# Altium schematic sheet [11] - TK2560_ISP.SchDoc
size A4; Organization: Altium Limited; Address1: L3, 12a Rodborough Rd; Address2: Frenchs Forest; Address3: NSW; Address4: Australia 2086; SheetNumber: 12; SheetTotal: 15
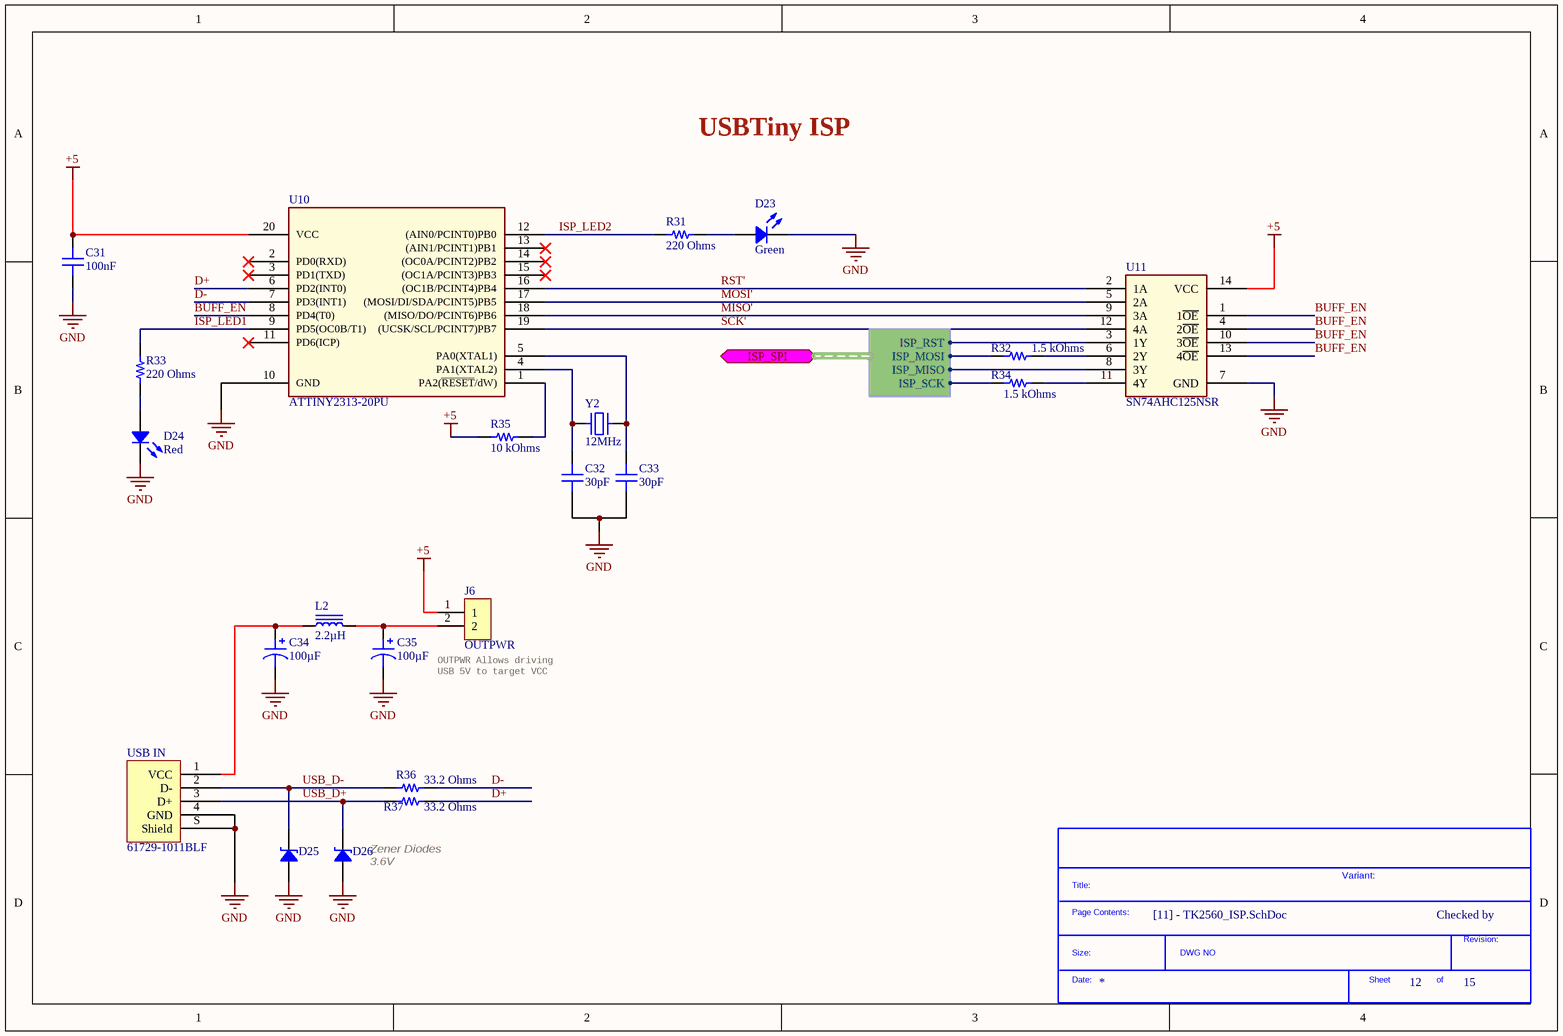
[diagram p0: [11] - TK2560_ISP.SchDoc]

## Parts
*?  SDTitleBlock  (value not drawn)  (graphical)
C31  100nF  [CAP 0805_2012]
C32  30pF  [CAP 0805_2012]
C33  30pF  [CAP 0805_2012]
C34  100µF  [CAP ALSMD 6.6MM H5.4MM]
C35  100µF  [CAP ALSMD 6.6MM H5.4MM]
D23  Green  [LED 0805_2012 GREEN]
D24  Red  [LED 1206_3216 RED]
D25  MMSZ5227B-E3-08  [SOD-123]  (value not drawn)
D26  MMSZ5227B-E3-08  [SOD-123]  (value not drawn)
J6  OUTPWR  [HDR_1x2]
L2  2.2µH  [IND 0806_2016]
R31  220 Ohms  [RES 0805_2012]
R32  1.5 kOhms  [RES 0805_2012]
R33  220 Ohms  [RES 0805_2012]
R34  1.5 kOhms  [RES 0805_2012]
R35  10 kOhms  [RES 0805_2012]
R36  33.2 Ohms  [RES 0805_2012]
R37  33.2 Ohms  [RES 0805_2012]
U10  ATTINY2313-20PU  [DIP20]
U11  SN74AHC125NSR  [14-SOIC_5.3MM]
USB_IN  61729-1011BLF  [FCI USB 61729-1011BLF]
Y2  12MHz  [ABRACON ABLS]

## Ports
ISP_SPI (bidir, harness ISP_SPI)

## Harnesses
ISP_SPI: ISP_RST, ISP_MOSI, ISP_MISO, ISP_SCK

## Nets
+5: C31.2 J6.1 R35.2 U10.20(VCC) U11.14(VCC)
GND: C31.1 C32.2 C33.2 C34.2 C35.2 D23.2 D24.2 D25.1 D26.1 U10.10(GND) U11.7(GND) USB_IN.4(GND) USB_IN.S(Shield)
BUFF_EN: U10.8(PD4(T0)) U11.1(1~{OE}) U11.4(2~{OE}) U11.10(3~{OE}) U11.13(4~{OE})
D+: R37.2 U10.6(PD2(INT0))
D-: R36.2 U10.7(PD3(INT1))
ISP_LED1: R33.2 U10.9(PD5(OC0B/T1))
ISP_LED2: R31.1 U10.12((AIN0/PCINT0)PB0)
MISO': U10.18((MISO/DO/PCINT6)PB6) U11.9(3A)
MOSI': U10.17((MOSI/DI/SDA/PCINT5)PB5) U11.5(2A)
RST': U10.16((OC1B/PCINT4)PB4) U11.2(1A)
SCK': U10.19((UCSK/SCL/PCINT7)PB7) U11.12(4A)
USB_D+: D26.2 R37.1 USB_IN.3(D+)
USB_D-: D25.2 R36.1 USB_IN.2(D-)
NetC32_1: C32.1 U10.4(PA1(XTAL2)) Y2.2
NetC33_1: C33.1 U10.5(PA0(XTAL1)) Y2.1
NetC34_1: C34.1 L2.1 USB_IN.1(VCC)
NetC35_1: C35.1 J6.2 L2.2
NetD23_1: D23.1 R31.2
NetD24_1: D24.1 R33.1
NetR32_1: R32.1 ; port ISP_SPI.ISP_MOSI
NetR32_2: R32.2 U11.6(2Y)
NetR34_1: R34.1 ; port ISP_SPI.ISP_SCK
NetR34_2: R34.2 U11.11(4Y)
NetR35_1: R35.1 U10.1(PA2(~{RESET}/dW))
NetU11_3: U11.3(1Y) ; port ISP_SPI.ISP_RST
NetU11_8: U11.8(3Y) ; port ISP_SPI.ISP_MISO

Not connected (* = marked no-connect by the designer): U10 2(PD0(RXD))* 3(PD1(TXD))* 11(PD6(ICP))* 13((AIN1/PCINT1)PB1)* 14((OC0A/PCINT2)PB2)* 15((OC1A/PCINT3)PB3)*

## Notes on the sheet
- USBTiny ISP
- (near J6) OUTPWR Allows driving USB 5V to target VCC
- Zener Diodes 3.6V
- Variant:
- Checked by
- Title
- Size:
- Date:
- A4
- Number:
- Time:
- Revision:
- Sheet
- of
- File:
- (in symbol SDTitleBlock) Title:; Page Contents:; Revision:; Size:; DWG NO; Date:; Sheet; of

## Library data of the parts
C31 = AC0805KKX8R9BB104: CAP CER 0805 10% X8R 50V 100NF; Manufacturer: Yageo; Capacitance: 0.1µF; Part Number: AC0805KKX8R9BB104; Value: 100nF; Applications: Automotive; ComponentLink1Description: Datasheet; ComponentLink1URL: http://www.yageo.com/documents/recent/AC0805KKX8R9BB104.pdf; ComponentLink2Description: DigiKey Link; ComponentLink2URL: http://digikey.com/product-detail/en/yageo/AC0805KKX8R9BB104/311-4624-1-ND/9699550; Device Package: 0805 (2012 Metric); LastUpdated: 02/09/2020 01:04:20; Lifecycle Status: Active; Minimum Order: 1; Mounting Type: Surface Mount, MLCC; Operating Temperature: -55°C ~ 150°C; Package / Case: 0805 (2012 Metric); Packaging: TapeAndReel; PartId: 14076; Part Status: Active; Price: 0.06; Ratings: AEC-Q200; Series: AC; Size / Dimension: 0.079" L x 0.049" W (2.00mm x 1.25mm); Supplier 1: DigiKey; Supplier Part Number 1: 311-4624-1-ND; Temperature Coefficient: X8R; Thickness (Max): 0.057" (1.45mm); Tolerance: ±10%; Voltage - Rated: 50V
C32 C33 = C0805C300M3GAC7800: CAP CER 30PF 25V NP0 0805; Manufacturer: KEMET; Temperature Coefficient: C0G, NP0; Tolerance: ±20%; Part Number: C0805C300M3GAC7800; Value: 30pF; Applications: General Purpose; Capacitance: 30pF; ComponentLink1Description: Datasheet; ComponentLink1URL: https://api.kemet.com/component-edge/download/datasheet/C0805C300M3GACTU.pdf; ComponentLink2Description: DigiKey Link; ComponentLink2URL: http://digikey.com/product-detail/en/kemet/C0805C300M3GAC7800/399-17444-1-ND/8570411; Device Package: 0805 (2012 Metric); Features: Low ESL; LastUpdated: 9/2/2020 01:04:15; Lifecycle Status: Active; Minimum Order: 1; Mounting Type: Surface Mount, MLCC; Operating Temperature: -55°C ~ 125°C; Package / Case: 0805 (2012 Metric); Packaging: TapeAndReel; PartId: 15688; Part Status: Active; Price: 0.05; Series: SMD Comm C0G; Size / Dimension: 0.079" L x 0.049" W (2.00mm x 1.25mm); Supplier 1: DigiKey; Supplier Part Number 1: 399-17444-1-ND; Thickness (Max): 0.035" (0.88mm); Voltage - Rated: 25V
C34 C35 = UUQ1A101MCL1GB: CAP ALUM 100UF 20% 10V SMD; Manufacturer: Nichicon; Lifetime @ Temp.: 1000 Hrs @ 105°C; Polarization: Polar; Ripple Current @ High Frequency: 90mA @ 10kHz; Ripple Current @ Low Frequency: 60mA @ 120Hz; Surface Mount Land Size: 0.260" L x 0.260" W (6.60mm x 6.60mm); Part Number: UUQ1A101MCL1GB; Applications: Audio; Capacitance: 100µF; ComponentLink1Description: Datasheet; ComponentLink1URL: http://nichicon-us.com/english/products/pdfs/e-uuq.pdf; ComponentLink2Description: DigiKey Link; ComponentLink2URL: http://digikey.com/product-detail/en/nichicon/UUQ1A101MCL1GB/493-16092-1-ND/6556079; Device Package: Radial, Can - SMD; Height - Seated (Max): 0.213" (5.40mm); LastUpdated: 9/2/2020 01:18:33; Lifecycle Status: Active; Minimum Order: 1; Mounting Type: Surface Mount; Operating Temperature: -40°C ~ 105°C; Package / Case: Radial, Can - SMD; Packaging: TapeAndReel; PartId: 8786; Part Status: Active; Price: 0.18; Series: UUQ; Size / Dimension: 0.248" Dia (6.30mm); Supplier 1: DigiKey; Supplier Part Number 1: 493-16092-1-ND; Tolerance: ±20%; Value: 100µF; Voltage - Rated: 10V
D23 = QTLP630C4TR: LED GREEN CLEAR 0805 SMD; Manufacturer: Everlight Electronics Co Ltd; Configuration: Standard; Current - Test: 20mA; Lens Color: Colorless; Lens Size: 1.40mm x 1.25mm; Lens Style: Rectangle with Flat Top; Millicandela Rating: 10mcd; Viewing Angle: 140°; Voltage - Forward (Vf) (Typ): 2.1V; Wavelength - Dominant: 570nm; Wavelength - Peak: 565nm; Part Number: QTLP630C4TR; Color: Green; ComponentLink1Description: Datasheet; ComponentLink1URL: //media.digikey.com/PDF/Data%20Sheets/Everlight%20PDFs/QTLP630-2.pdf; ComponentLink2Description: DigiKey Link; ComponentLink2URL: http://digikey.com/product-detail/en/everlight-electronics-co-ltd/QTLP630C4TR/1080-1411-1-ND/2676145; Device Package: 0805 (2012 Metric); Height (Max): 1.20mm; LastUpdated: 02/09/2020 01:21:05; Lens Transparency: Clear; Lifecycle Status: Active; Minimum Order: 1; Mounting Type: Surface Mount; Package / Case: 0805 (2012 Metric); Packaging: TapeAndReel; PartId: 240; Part Status: Active; Price: 0.06; Series: -; Size / Dimension: 2.00mm L x 1.25mm W; Supplier 1: DigiKey; Supplier Part Number 1: 1080-1411-1-ND; Supplier Device Package: 0805; Value: Green
D24 = XZMDK55W-A2RT: LED RED CLEAR 2SMD; Manufacturer: SunLED; Configuration: Standard; Current - Test: 20mA; Lens Color: Colorless; Lens Size: 1.10mm Dia; Lens Style: Round with Flat Top; Millicandela Rating: 228mcd; Viewing Angle: 70°; Voltage - Forward (Vf) (Typ): 1.95V; Wavelength - Dominant: 630nm; Wavelength - Peak: 645nm; Part Number: XZMDK55W-A2RT; Color: Red; ComponentLink1Description: Datasheet; ComponentLink1URL: https://www.sunledusa.com/products/spec/XZMDK55W-A2RT.pdf; ComponentLink2Description: DigiKey Link; ComponentLink2URL: http://digikey.com/product-detail/en/sunled/XZMDK55W-A2RT/1497-1289-1-ND/5775269; Device Package: 1206 (3216 Metric); Height (Max): 1.20mm; LastUpdated: 02/09/2020 01:21:09; Lens Transparency: Clear; Lifecycle Status: Active; Minimum Order: 1; Mounting Type: Surface Mount; Package / Case: 1206 (3216 Metric); Packaging: TapeAndReel; PartId: 183; Part Status: Active; Price: 0.08; Series: -; Size / Dimension: 3.20mm L x 1.60mm W; Supplier 1: DigiKey; Supplier Part Number 1: 1497-1289-1-ND; Supplier Device Package: 2-SMD; Value: Red
D25 D26 = MMSZ5227B-E3-08: DIODE ZENER 3.6V 500MW SOD123; Manufacturer: Vishay Semiconductor Diodes Division; Current - Reverse Leakage @ Vr: 15µA @ 1V; Impedance (Max) (Zzt): 24 Ohms; Tolerance: ±5%; Part Number: MMSZ5227B-E3-08; ComponentLink1Description: Datasheet; ComponentLink1URL: http://www.vishay.com/docs/85774/mmsz5225.pdf; ComponentLink2Description: DigiKey Link; ComponentLink2URL: http://digikey.com/product-detail/en/vishay-semiconductor-diodes-division/MMSZ5227B-E3-08/MMSZ5227B-E3-08GICT-ND/8565138; LastUpdated: 9/2/2020 01:19:27; Lifecycle Status: Active; Minimum Order: 1; Mounting Type: Surface Mount; Operating Temperature: -55°C ~ 150°C; Package / Case: SOD-123; Packaging: TapeAndReel; PartId: 1713; Part Status: Active; Power - Max: 500mW; Price: 0.05; Series: Automotive, AEC-Q101; Supplier 1: DigiKey; Supplier Part Number 1: MMSZ5227B-E3-08GICT-ND; Supplier Device Package: SOD-123; Voltage - Zener (Nom) (Vz): 3.6V
J6 = HDR_1x2: Pin Header 2.54MM Pitch Str, 1X2PIN, Full G/f, NY6T, 6.1MM*2.5MM*3.0MM / Bag; Manufacturer: Amphenol; Manufacturer Part Number: G800W306018EU; Supplier 1: Mouser; Stock 1: 1088; Pricing 1: 1=0.10000, 10=0.02700, 50=0.02700, 100=0.02600, 1000=0.02200, 10000=0.01900 (USD); RoHS Compliant: Yes; Supplier Part Number 1: 523-G800W306018EU
L2 = DFE201610P-2R2M=P2: FIXED IND 2.2UH 2A 168 MOHM SMD; Manufacturer: Murata Electronics; DC Resistance (DCR): 168mOhm Max; Inductance Frequency - Test: 1MHz; Material - Core: Iron Powder; Shielding: Shielded; Tolerance: ±20%; Type: Wirewound; Part Number: DFE201610P-2R2M=P2; ComponentLink1Description: Datasheet; ComponentLink1URL: https://www.murata.com/~/media/webrenewal/products/inductor/chip/tokoproducts/wirewoundmetalalloychiptype/m_dfe201610p.ashx; ComponentLink2Description: DigiKey Link; ComponentLink2URL: http://digikey.com/product-detail/en/murata-electronics/DFE201610P-2R2M=P2/490-10609-1-ND/5272046; Current Rating (Amps): 2A; Device Package: 0806 (2016 Metric); Height - Seated (Max): 0.039" (1.00mm); Inductance: 2.2µH; LastUpdated: 9/2/2020 01:24:34; Lifecycle Status: Active; Minimum Order: 1; Mounting Type: Surface Mount; Operating Temperature: -40°C ~ 125°C; Package / Case: 0806 (2016 Metric); Packaging: TapeAndReel; PartId: 3036; Part Status: Active; Price: 0.17; Series: DFE201610P; Size / Dimension: 0.079" L x 0.063" W (2.00mm x 1.60mm); Supplier 1: DigiKey; Supplier Part Number 1: 490-10609-1-ND; Supplier Device Package: 0806 (2016 Metric); Value: 2.2µH
R31 R33 = RK73H2ATTD2200F: RES 220 OHM 1% 1/4W 0805; Manufacturer: KOA Speer Electronics, Inc.; Power (Watts): 0.25W, 1/4W; Temperature Coefficient: ±100ppm/°C; Part Number: RK73H2ATTD2200F; Value: 220 Ohms; ComponentLink1Description: Datasheet; ComponentLink1URL: http://www.koaspeer.com/catimages/Products/RK73H/RK73H.pdf; ComponentLink2Description: DigiKey Link; ComponentLink2URL: http://digikey.com/product-detail/en/koa-speer-electronics-inc/RK73H2ATTD2200F/2019-RK73H2ATTD2200FCT-ND/10235084; Composition: Thick Film; Device Package: 0805 (2012 Metric); Features: Automotive AEC-Q200, Moisture Resistant; Height - Seated (Max): 0.024" (0.60mm); LastUpdated: 02/09/2020 01:15:09; Lifecycle Status: Active; Minimum Order: 1; Number of Terminations: 2; Operating Temperature: -55°C ~ 155°C; Package / Case: 0805 (2012 Metric); Packaging: CutTape; PartId: 34624; Part Status: Active; Price: 0.10; Ratings: AEC-Q200; Resistance: 220 Ohms; Series: RK73H; Size / Dimension: 0.079" L x 0.049" W (2.00mm x 1.25mm); Supplier 1: DigiKey; Supplier Part Number 1: 2019-RK73H2ATTD2200FCT-ND; Supplier Device Package: 0805; Tolerance: ±1%
R32 R34 = SG73S2ATTD1501F: RES 1.5K OHM 1% 1/4W 0805; Manufacturer: KOA Speer Electronics, Inc.; Power (Watts): 0.25W, 1/4W; Temperature Coefficient: ±200ppm/°C; Part Number: SG73S2ATTD1501F; Value: 1.5 kOhms; ComponentLink1Description: Datasheet; ComponentLink1URL: http://www.koaspeer.com/catimages/Products/SG73S/SG73S.pdf; ComponentLink2Description: DigiKey Link; ComponentLink2URL: http://digikey.com/product-detail/en/koa-speer-electronics-inc/SG73S2ATTD1501F/2019-SG73S2ATTD1501FCT-ND/10280016; Composition: Thick Film; Device Package: 0805 (2012 Metric); Features: Automotive AEC-Q200, Moisture Resistant, Pulse Withstanding; Height - Seated (Max): 0.024" (0.60mm); LastUpdated: 9/2/2020 01:14:56; Lifecycle Status: Active; Minimum Order: 1; Number of Terminations: 2; Operating Temperature: -55°C ~ 155°C; Package / Case: 0805 (2012 Metric); Packaging: TapeAndReel; PartId: 40460; Part Status: Active; Price: 0.02; Ratings: AEC-Q200; Resistance: 1.5 kOhms; Series: SG73S; Size / Dimension: 0.079" L x 0.049" W (2.00mm x 1.25mm); Supplier 1: DigiKey; Supplier Part Number 1: 2019-SG73S2ATTD1501FCT-ND; Supplier Device Package: 0805; Tolerance: ±1%
R35 = SG73S2ATTD103J: RES 10K OHM 5% 1/4W 0805; Manufacturer: KOA Speer Electronics, Inc.; Power (Watts): 0.25W, 1/4W; Temperature Coefficient: ±200ppm/°C; Part Number: SG73S2ATTD103J; Value: 10 kOhms; ComponentLink1Description: Datasheet; ComponentLink1URL: http://www.koaspeer.com/catimages/Products/SG73S/SG73S.pdf; ComponentLink2Description: DigiKey Link; ComponentLink2URL: http://digikey.com/product-detail/en/koa-speer-electronics-inc/SG73S2ATTD103J/2019-SG73S2ATTD103JCT-ND/10280158; Composition: Thick Film; Device Package: 0805 (2012 Metric); Features: Automotive AEC-Q200, Moisture Resistant, Pulse Withstanding; Height - Seated (Max): 0.024" (0.60mm); LastUpdated: 9/2/2020 01:14:56; Lifecycle Status: Active; Minimum Order: 1; Number of Terminations: 2; Operating Temperature: -55°C ~ 155°C; Package / Case: 0805 (2012 Metric); Packaging: TapeAndReel; PartId: 40412; Part Status: Active; Price: 0.01; Ratings: AEC-Q200; Resistance: 10 kOhms; Series: SG73S; Size / Dimension: 0.079" L x 0.049" W (2.00mm x 1.25mm); Supplier 1: DigiKey; Supplier Part Number 1: 2019-SG73S2ATTD103JCT-ND; Supplier Device Package: 0805; Tolerance: ±5%
R36 R37 = RNCP0805FTD33R2: RES 33.2 OHM 1% 1/4W 0805; Manufacturer: Stackpole Electronics Inc; Power (Watts): 0.25W, 1/4W; Temperature Coefficient: ±100ppm/°C; Part Number: RNCP0805FTD33R2; Value: 33.2 Ohms; ComponentLink1Description: Datasheet; ComponentLink1URL: https://www.seielect.com/catalog/sei-rncp.pdf; ComponentLink2Description: DigiKey Link; ComponentLink2URL: http://digikey.com/product-detail/en/stackpole-electronics-inc/RNCP0805FTD33R2/RNCP0805FTD33R2CT-ND/2240540; Composition: Thin Film; Device Package: 0805 (2012 Metric); Features: Anti-Sulfur, Moisture Resistant; Height - Seated (Max): 0.024" (0.60mm); LastUpdated: 9/2/2020 01:15:14; Lifecycle Status: Active; Minimum Order: 1; Number of Terminations: 2; Operating Temperature: -55°C ~ 155°C; Package / Case: 0805 (2012 Metric); Packaging: TapeAndReel; PartId: 32239; Part Status: Active; Price: 0.01; Resistance: 33.2 Ohms; Series: RNCP; Size / Dimension: 0.079" L x 0.049" W (2.00mm x 1.25mm); Supplier 1: DigiKey; Supplier Part Number 1: RNCP0805FTD33R2CT-ND; Supplier Device Package: 0805; Tolerance: ±1%
U10 = ATTINY2313-20PU: ATMEL         ATTINY2313-20PU            8 Bit Microcontroller, Low Power High Performance, ATtiny, 20 MHz, 2 KB, 128 Byte, 20 Pins, DIP; Manufacturer: Microchip / Atmel; Interface: SPI,UART,USART; Min Supply Voltage: 2.7V; Max Supply Voltage: 5.5V; Frequency: 20MHz; Oscillator Type: Internal; Memory Type: FLASH,EEPROM; Memory Size: 2KB; Peripherals: Brown-out Detect/Reset,POR,PWM,WDT; Number of Timers/Counters: 2; RAM Size: 128B; Number of I/Os: 18; Number of PWM Channels: 4; Number of UART Channels: 1; Data Bus Width: 8b; Number of Bits: 8; Watchdog Timer: Yes; Access Time: 20us; Core Architecture: AVR; Manufacturer Part Number: ATTINY2313-20PU; RoHS: Yes; Category: Microcontrollers; Stock 1: 1963; Pricing 1: 1=1.93000, 25=1.77120, 100=1.59500 (USD); Mount: Through Hole; Case/Package: DIP; Number of Pins: 20; Contact Plating: Tin,Matte; Min Operating Temperature: -40°C; Max Operating Temperature: 85°C; Packaging: Rail/Tube; Package Quantity: 18; Density: 2KB; Number of Programmable I/O: 18; Max Frequency: 20MHz; Number of SPI Channels: 2; Number of I2C Channels: 1; Address Bus Width: 8b; Series: AVR® ATtiny; Length: 25.98mm; Width: 7.112mm; Height: 4.953mm; Radiation Hardening: No; RoHS Compliant: Yes; REACH SVHC: No SVHC; Lead Free: Lead Free; ComponentLink1URL: https://datasheet.ciiva.com/1167/doc2543-1167040.pdf?src-supplier=Newark; ComponentLink1Description: https://datasheet.ciiva.com/1167/doc2543-1167040.pdf?src-supplier=Newark; ComponentLink2URL: https://datasheet.ciiva.com/19481/1537061-19481586.pdf?src-supplier=Jameco; ComponentLink2Description: https://datasheet.ciiva.com/19481/1537061-19481586.pdf?src-supplier=Jameco; ComponentLink3URL: https://datasheet.ciiva.com/15122/getdatasheetpartid-143079-15122628.pdf?src-supplier=Verical; ComponentLink3Description: https://datasheet.ciiva.com/15122/getdatasheetpartid-143079-15122628.pdf?src-supplier=Verical; ComponentLink4URL: https://datasheet.ciiva.com/20168/73-4316-20168308.pdf?src-supplier=Rapid+Electronics; ComponentLink4Description: https://datasheet.ciiva.com/20168/73-4316-20168308.pdf?src-supplier=Rapid+Electronics; ComponentLink5URL: https://datasheet.ciiva.com/14132/gn645062-14132485.pdf?src-supplier=Distrelec; ComponentLink5Description: https://datasheet.ciiva.com/14132/gn645062-14132485.pdf?src-supplier=Distrelec; ComponentLink6URL: https://datasheet.ciiva.com/1158/1131078-1158423.pdf?src-supplier=Element14; ComponentLink6Description: https://datasheet.ciiva.com/1158/1131078-1158423.pdf?src-supplier=Element14; ComponentLink7URL: https://datasheet.ciiva.com/26207/doc2543-26207001.pdf?src-supplier=Avnet+Europe; ComponentLink7Description: https://datasheet.ciiva.com/26207/doc2543-26207001.pdf?src-supplier=Avnet+Europe; ComponentLink8URL: https://datasheet.ciiva.com/6639/doc2543-6639931.pdf?src-supplier=Digi-Key; ComponentLink8Description: https://datasheet.ciiva.com/6639/doc2543-6639931.pdf?src-supplier=Digi-Key; ComponentLink9URL: https://datasheet.ciiva.com/3203/doc2543-3203135.pdf?src-supplier=Avnet; ComponentLink9Description: https://datasheet.ciiva.com/3203/doc2543-3203135.pdf?src-supplier=Avnet; Supplier 1: Digi-Key; Supplier Part Number 1: ATTINY2313-20PU-ND
U11 = SN74AHC125NSR: Buffer/Line Driver 4-CH Non-Inverting 3-ST CMOS 14-Pin SOP T/R; Manufacturer: Texas Instruments; Number of Elements: 4; Max Supply Voltage: 5.5V; Min Supply Voltage: 2V; Propagation Delay: 7.5ns; Logic Function: Buffer,Inverting; Number of Bits per Element: 1; High Level Output Current: -8mA; Low Level Output Current: 8mA; Turn-On Delay Time: 15ns; Quiescent Current: 4uA; Output Type: 3-STATE; Manufacturer Part Number: SN74AHC125NSR; RoHS: Yes; Category: Buffers, Drivers and Transceivers; Stock 1: 3905; Pricing 1: 1=0.43000, 10=0.36600, 25=0.34120, 100=0.27310, 250=0.25356, 500=0.21454, 1000=0.16578 (USD); Mount: Surface Mount; Case/Package: SO; Number of Pins: 14; Min Operating Temperature: -40°C; Max Operating Temperature: 125°C; Package Quantity: 2000; Packaging: Tape and Reel; Number of Channels: 4; Number of Inputs: 4; Number of Outputs: 4; Number of Input Lines: 4; Number of Output Lines: 4; Polarity: Non-Inverting; Number of Bits: 4; Series: 74AHC; Technology: CMOS; Lead Free: Lead Free; RoHS Compliant: Yes; ComponentLink1URL: https://datasheet.ciiva.com/6623/sn74ahc125-6623637.pdf?src-supplier=Digi-Key; ComponentLink1Description: https://datasheet.ciiva.com/6623/sn74ahc125-6623637.pdf?src-supplier=Digi-Key; Supplier 1: Digi-Key; Supplier Part Number 1: 296-31733-1-ND
USB_IN = 61729-1011BLF: CONN RCPT USB2.0 TYPEB 4POS R/A; Manufacturer: Amphenol ICC (FCI); Connector Type: USB - B; Current Rating (Amps): 1A; Gender: Receptacle; Mating Cycles: 1500; Number of Contacts: 4; Number of Ports: 1; Shielding: Shielded; Part Number: 61729-1011BLF; ComponentLink1Description: Datasheet; ComponentLink1URL: http://www.amphenol-icc.com/media/wysiwyg/files/drawing/61729.pdf; ComponentLink2Description: DigiKey Link; ComponentLink2URL: //digikey.com/product-detail/en/amphenol-icc-fci/61729-1011BLF/609-3657-ND/1490763; Features: Board Lock; LastUpdated: 12/9/2019 20:52:52; Lifecycle Status: 0; Minimum Order: 1; Mounting Feature: Horizontal; Mounting Type: Through Hole, Right Angle; Operating Temperature: -55°C ~ 85°C; Packaging: Tube; Part Status: Active; Price: 0.99; Series: 61729; Specifications: USB 2.0; Supplier 1: DigiKey; Supplier Part Number 1: 609-3657-ND; Termination: Solder
Y2 = ABLS-12.000MHZ-30-A-4-H-T: CRYSTAL 12.0000MHZ 30PF SMD; Manufacturer: Abracon LLC; ESR (Equivalent Series Resistance): 50 Ohms; Frequency Stability: ±35ppm; Frequency Tolerance: ±30ppm; Operating Mode: Fundamental; Part Number: ABLS-12.000MHZ-30-A-4-H-T; ComponentLink1Description: Datasheet; ComponentLink1URL: https://abracon.com/Resonators/abls.pdf; ComponentLink2Description: DigiKey Link; ComponentLink2URL: http://digikey.com/product-detail/en/abracon-llc/ABLS-12.000MHZ-30-A-4-H-T/535-14871-1-ND/9997948; Frequency: 12MHz; Height - Seated (Max): 0.165" (4.20mm); LastUpdated: 9/2/2020 01:21:46; Lifecycle Status: Active; Load Capacitance: 30pF; Minimum Order: 1; Mounting Type: Surface Mount; Operating Temperature: -10°C ~ 60°C; Package / Case: HC-49/US; Packaging: TapeAndReel; PartId: 82; Part Status: Active; Price: 0.14; Series: ABLS; Size / Dimension: 0.449" L x 0.185" W (11.40mm x 4.70mm); Supplier 1: DigiKey; Supplier Part Number 1: 535-14871-1-ND; Type: MHz Crystal; Value: 12MHz